# EAGLE design July (EAGLE 9.0.1)
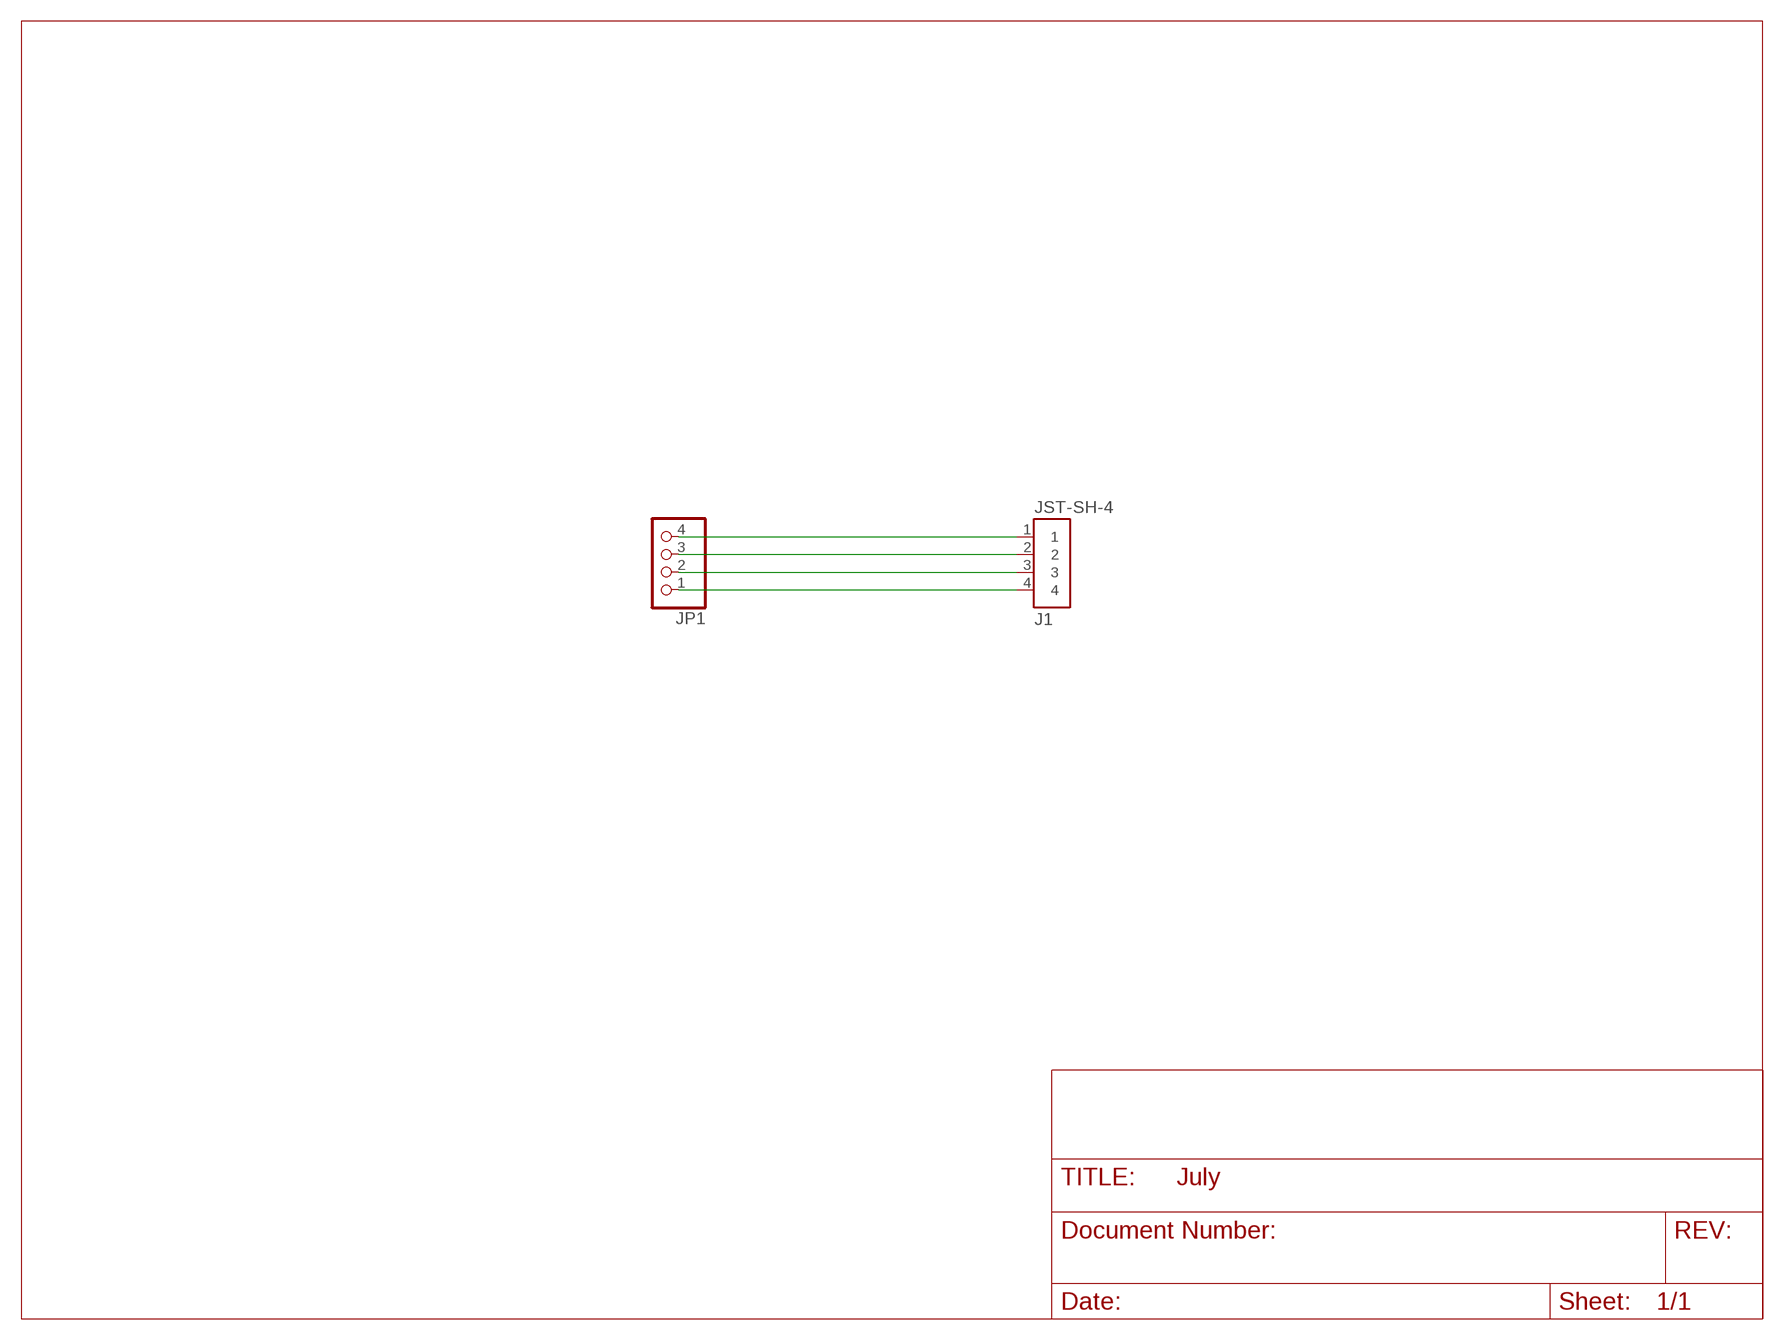
[diagram p0: schematic, sheet 1]

## Parts
J1  JST-SH-4  [JST-S4B-SH-SM4-TB]
JP1  PINHD-1X4  [1X04]

## Nets
N$1: J1.1 JP1.4
N$2: J1.2 JP1.3
N$3: J1.3 JP1.2
N$4: J1.4 JP1.1

## Library data of the parts
J1 = Ooo-Connectors:JST-SH-4
JP1 = pinhead:PINHD-1X4: PIN HEADER

## Board
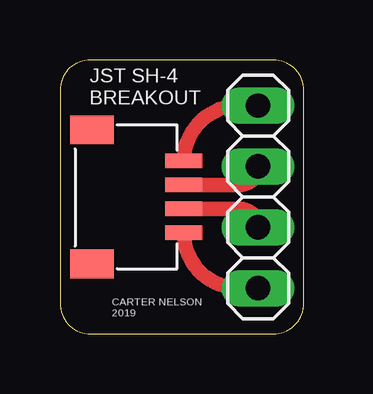
[diagram p1: board, top side]

Size 10.16 x 11.43 mm. Coordinates in mm from the lower left corner, seen from the top.
Outline: 0,10.16 0,1.27 arc90 1.27,0 8.89,0 arc90 10.16,1.27 10.16,10.16 arc90 8.89,11.43 1.27,11.43 arc90 0,10.16
Copper layers (1*16): Top 0.035559375mm / dielectric 1.6mm / Bottom 0.035559375mm
Design rules "oshpark-2layer": minimum track width 6mil, minimum drill 10mil, track to track 6mil, track to pad 6mil, pad to pad 6mil, via to via 6mil, smd to smd 6mil, copper to edge 15mil, drill to drill 6mil, minimum pad ring 5mil, minimum via ring 5mil, stop-mask expansion 2.5mil, vias tented up to drill 0mil, thermal gap 10mil

### Footprints (pad centres in the part's own frame; a part is rotated, then mirrored left to right if it is on the bottom)
JST-S4B-SH-SM4-TB = smd 1.55 x 0.6: 1 -4.525,1.5; 2 -4.525,0.5; 3 -4.525,-0.5; 4 -4.525,-1.5 | smd 1.8 x 1.2: 5 -0.7,2.8; 6 -0.7,-2.8
1X04 = drill 1.016 long: 1 -3.81,0; 2 -1.27,0; 3 1.27,0; 4 3.81,0

### Placement (x,y rotation side)
J1  0.64,5.71 180 top
JP1  8.26,5.71 270 top

### Tracks (layer width: path | path; a pad name or v marks a point on that pad's centre or on a via)
N$1
  Top 0.61: J1.1 arc90 7.47,1.91 JP1.4
N$2
  Top 0.61: J1.2 7.49,5.21 arc-90 JP1.3
N$3
  Top 0.61: J1.3 7.49,6.21 arc90 JP1.2
N$4
  Top 0.61: J1.4 arc-90 7.47,9.53 JP1.1

### Text on the board
tPlace: JST SH-4 / BREAKOUT | CARTER NELSON / 2019